# Altium schematic sheet MCU.SchDoc
size A4
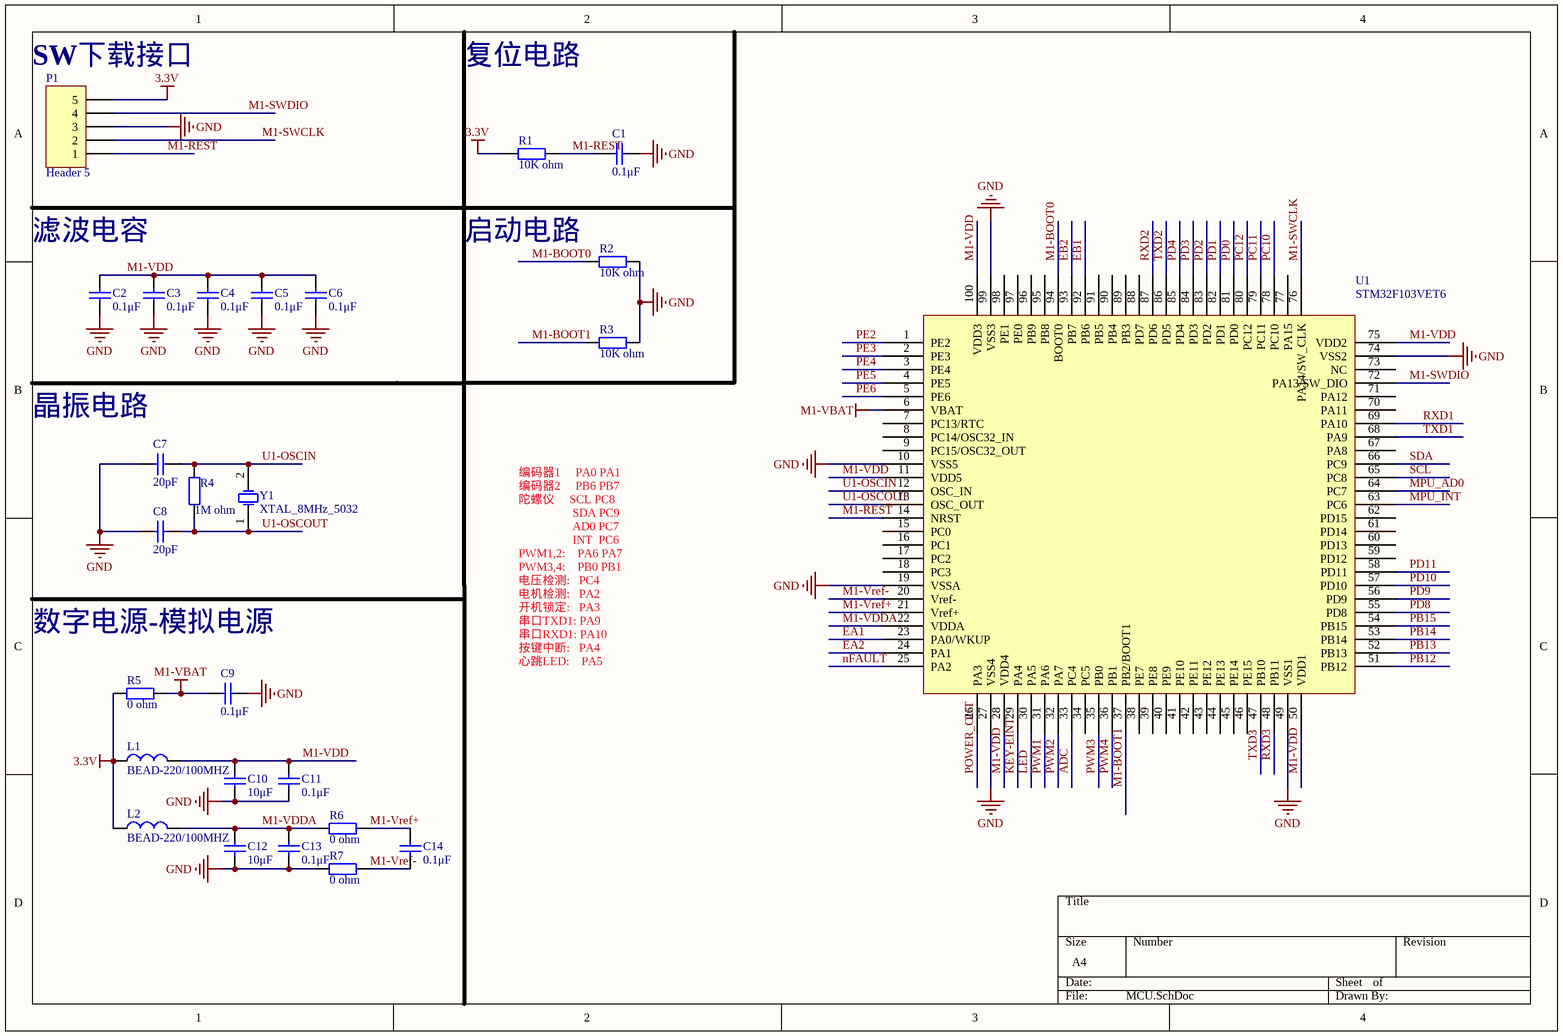
[diagram p0: MCU.SchDoc]

## Parts
C1  0.1μF  [0603C]
C2  0.1μF  [0603C]
C3  0.1μF  [0603C]
C4  0.1μF  [0603C]
C5  0.1μF  [0603C]
C6  0.1μF  [0603C]
C7  20pF  [0603C]
C8  20pF  [0603C]
C9  0.1μF  [0603C]
C10  10μF  [0603C]
C11  0.1μF  [0603C]
C12  10μF  [0603C]
C13  0.1μF  [0603C]
C14  0.1μF  [0603C]
L1  BEAD-220/100MHZ  [0603R]
L2  BEAD-220/100MHZ  [0603R]
P1  Header 5  [HDR1X5]
R1  10K ohm  [0603R]
R2  10K ohm  [0603R]
R3  10K ohm  [0603R]
R4  1M ohm  [0603R]
R5  0 ohm  [0603R]
R6  0 ohm  [0603R]
R7  0 ohm  [0603R]
U1  STM32F103VET6  [LQFP100]
Y1  XTAL_8MHz_5032  [5032]

## Nets
3.3V: L1.1 L2.1 P1.5 R1.1 R5.1
GND: C1.2 C2.1 C3.1 C4.1 C5.1 C6.1 C7.1 C8.1 C9.1 C10.1 C11.1 C12.1 C13.1 P1.3 R2.2 R3.2 R7.1 U1.10(VSS5) U1.19(VSSA) U1.27(VSS4) U1.49(VSS1) U1.74(VSS2) U1.99(VSS3)
M1-VBAT: C9.2 R5.2 U1.6(VBAT)
ADC: U1.33(PC4)
EA1: U1.23(PA0/WKUP)
EA2: U1.24(PA1)
EB1: U1.92(PB6)
EB2: U1.93(PB7)
KEY-EINT: U1.29(PA4)
LED: U1.30(PA5)
M1-BOOT0: R2.1 U1.94(BOOT0)
M1-BOOT1: R3.1 U1.37(PB2/BOOT1)
M1-REST: C1.1 P1.1 R1.2 U1.14(NRST)
M1-SWCLK: P1.2 U1.76(PA14/SW_CLK)
M1-SWDIO: P1.4 U1.72(PA13/SW_DIO)
M1-VDD: C2.2 C3.2 C4.2 C5.2 C6.2 C10.2 C11.2 L1.2 U1.11(VDD5) U1.28(VDD4) U1.50(VDD1) U1.75(VDD2) U1.100(VDD3)
M1-VDDA: C12.2 C13.2 L2.2 R6.1 U1.22(VDDA)
M1-Vref+: C14.2 R6.2 U1.21(Vref+)
M1-Vref-: C14.1 R7.2 U1.20(Vref-)
MPU_AD0: U1.64(PC7)
MPU_INT: U1.63(PC6)
nFAULT: U1.25(PA2)
PB12: U1.51(PB12)
PB13: U1.52(PB13)
PB14: U1.53(PB14)
PB15: U1.54(PB15)
PC10: U1.78(PC10)
PC11: U1.79(PC11)
PC12: U1.80(PC12)
PD0: U1.81(PD0)
PD1: U1.82(PD1)
PD2: U1.83(PD2)
PD3: U1.84(PD3)
PD4: U1.85(PD4)
PD8: U1.55(PD8)
PD9: U1.56(PD9)
PD10: U1.57(PD10)
PD11: U1.58(PD11)
PE2: U1.1(PE2)
PE3: U1.2(PE3)
PE4: U1.3(PE4)
PE5: U1.4(PE5)
PE6: U1.5(PE6)
POWER_OUT: U1.26(PA3)
PWM1: U1.31(PA6)
PWM2: U1.32(PA7)
PWM3: U1.35(PB0)
PWM4: U1.36(PB1)
RXD1: U1.69(PA10)
RXD2: U1.87(PD6)
RXD3: U1.48(PB11)
SCL: U1.65(PC8)
SDA: U1.66(PC9)
TXD1: U1.68(PA9)
TXD2: U1.86(PD5)
TXD3: U1.47(PB10)
U1-OSCIN: C7.2 R4.2 U1.12(OSC_IN) Y1.2(OSC2)
U1-OSCOUT: C8.2 R4.1 U1.13(OSC_OUT) Y1.1(OSC1)

Not connected (* = marked no-connect by the designer): U1 7(PC13/RTC) 8(PC14/OSC32_IN) 9(PC15/OSC32_OUT) 15(PC0) 16(PC1) 17(PC2) 18(PC3) 34(PC5) 38(PE7) 39(PE8) 40(PE9) 41(PE10) 42(PE11) 43(PE12) 44(PE13) 45(PE14) 46(PE15) 59(PD12) 60(PD13) 61(PD14) 62(PD15) 67(PA8) 70(PA11) 71(PA12) 73(NC) 77(PA15) 88(PD7) 89(PB3) 90(PB4) 91(PB5) 95(PB8) 96(PB9) 97(PE0) 98(PE1)

## Notes on the sheet
- (near P1) SW下载接口
- 复位电路
- 滤波电容
- 启动电路
- 晶振电路
- 数字电源-模拟电源
- 编码器1     PA0 PA1
  编码器2     PB6 PB7
  陀螺仪     SCL PC8
  SDA PC9
  AD0 PC7
  INT  PC6
  PWM1,2:    PA6 PA7
  PWM3,4:    PB0 PB1
  电压检测:   PC4
  电机检测:   PA2
  开机锁定:   PA3
  串口TXD1: PA9
  串口RXD1: PA10
  按键中断:   PA4
  心跳LED:    PA5

## Library data of the parts
C1-C6 C9 C11 C13 C14 = Cap_0.1μF_50V_0603: 0.1μF_50V,X7R,±5%; 物料名称: 贴片陶瓷电容; 制造商: muRata; 物料编码: TCC0087; 物料型号: GRM188R71H104JA93D; 单位: PCS; 物料规格: 0.1μF_50V,X7R,±5%
C7 C8 = Cap_20pF_50V_0603: 20pF_50V,CH,±5%; 物料名称: 贴片陶瓷电容; 制造商: muRata; 物料编码: TCC0036; 物料型号: GRM1882C1H200JA01D; 单位: PCS; 物料规格: 20pF_50V,CH,±5%
C10 C12 = Cap_10μF_35V_0603: 10μF_35V,X5R,20%; 物料规格: 10μF_35V,20%; 物料名称: 贴片陶瓷电容; 制造商: muRata; 物料编码: TCC0071; 物料型号: GRM188R6YA106MA73D; 单位: PCS
L1 L2 = BEAD-220/100MHZ_0603: 物料名称: 磁珠; 制造商: TDK; 物料编码: TCZ0006; 物料型号: MMZ1608B221CTAH0; 单位: PCS; 物料规格: BEAD-220/100MHZ
P1 = Header 5: Header, 5-Pin; LatestRevisionDate: 17-Jul-2002; LatestRevisionNote: Re-released for DXP Platform.; Publisher: Altium Limited
R1-R3 = Res_10K ohm_0603: 10K ohm,1%; 物料名称: 贴片电阻; 制造商: YAGEO; 物料编码: TRS0020; 物料型号: RC0603FR-0710KL; 单位: PCS; 物料规格: 10K ohm,1%
R4 = Res_1M ohm_0603: 1M ohm,1%; 物料名称: 贴片电阻; 制造商: YAGEO; 物料编码: TRS0067; 物料型号: RC0603FR-071ML; 单位: PCS; 物料规格: 1M ohm,1%
R5-R7 = Res_0 ohm_0603: 0 ohm,5%; 物料名称: 贴片电阻; 制造商: YAGEO; 物料编码: TRS0003; 物料型号: RC0603JR-070RL; 单位: PCS; 物料规格: 0 ohm,5%
U1 = STM32F103VET6: 物料名称: 32位微处理器; 制造商: ST; 物料编码: TIC0019; 单位: PCS; 物料规格: STM32F103VET6; 物料型号: STM32F103VET6
Y1 = XTAL_8MHz_5032: XTAL_8MHz; 物料规格: 8MHz; 物料名称: 晶振; 制造商: TAITIEN; 物料编码: NA; 物料型号: XIHCCCNANF-8.000; 单位: PCS